# Altium schematic sheet Sheet1.SchDoc
size A2; SheetNumber: 1; SheetTotal: 1
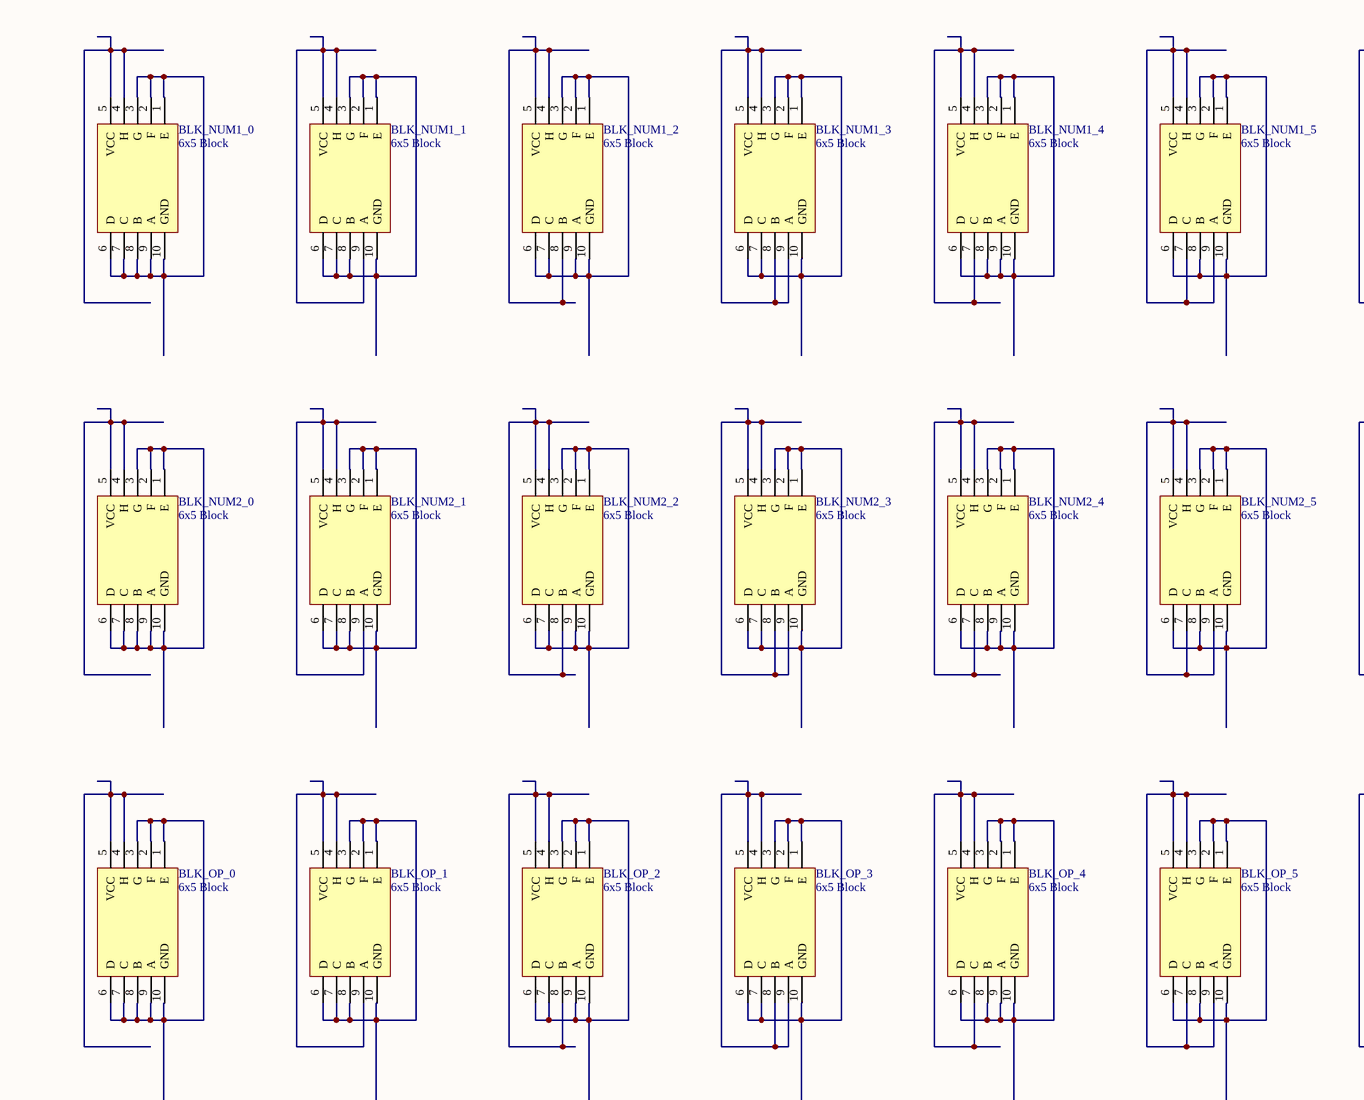
[diagram p0: Sheet1.SchDoc, left]
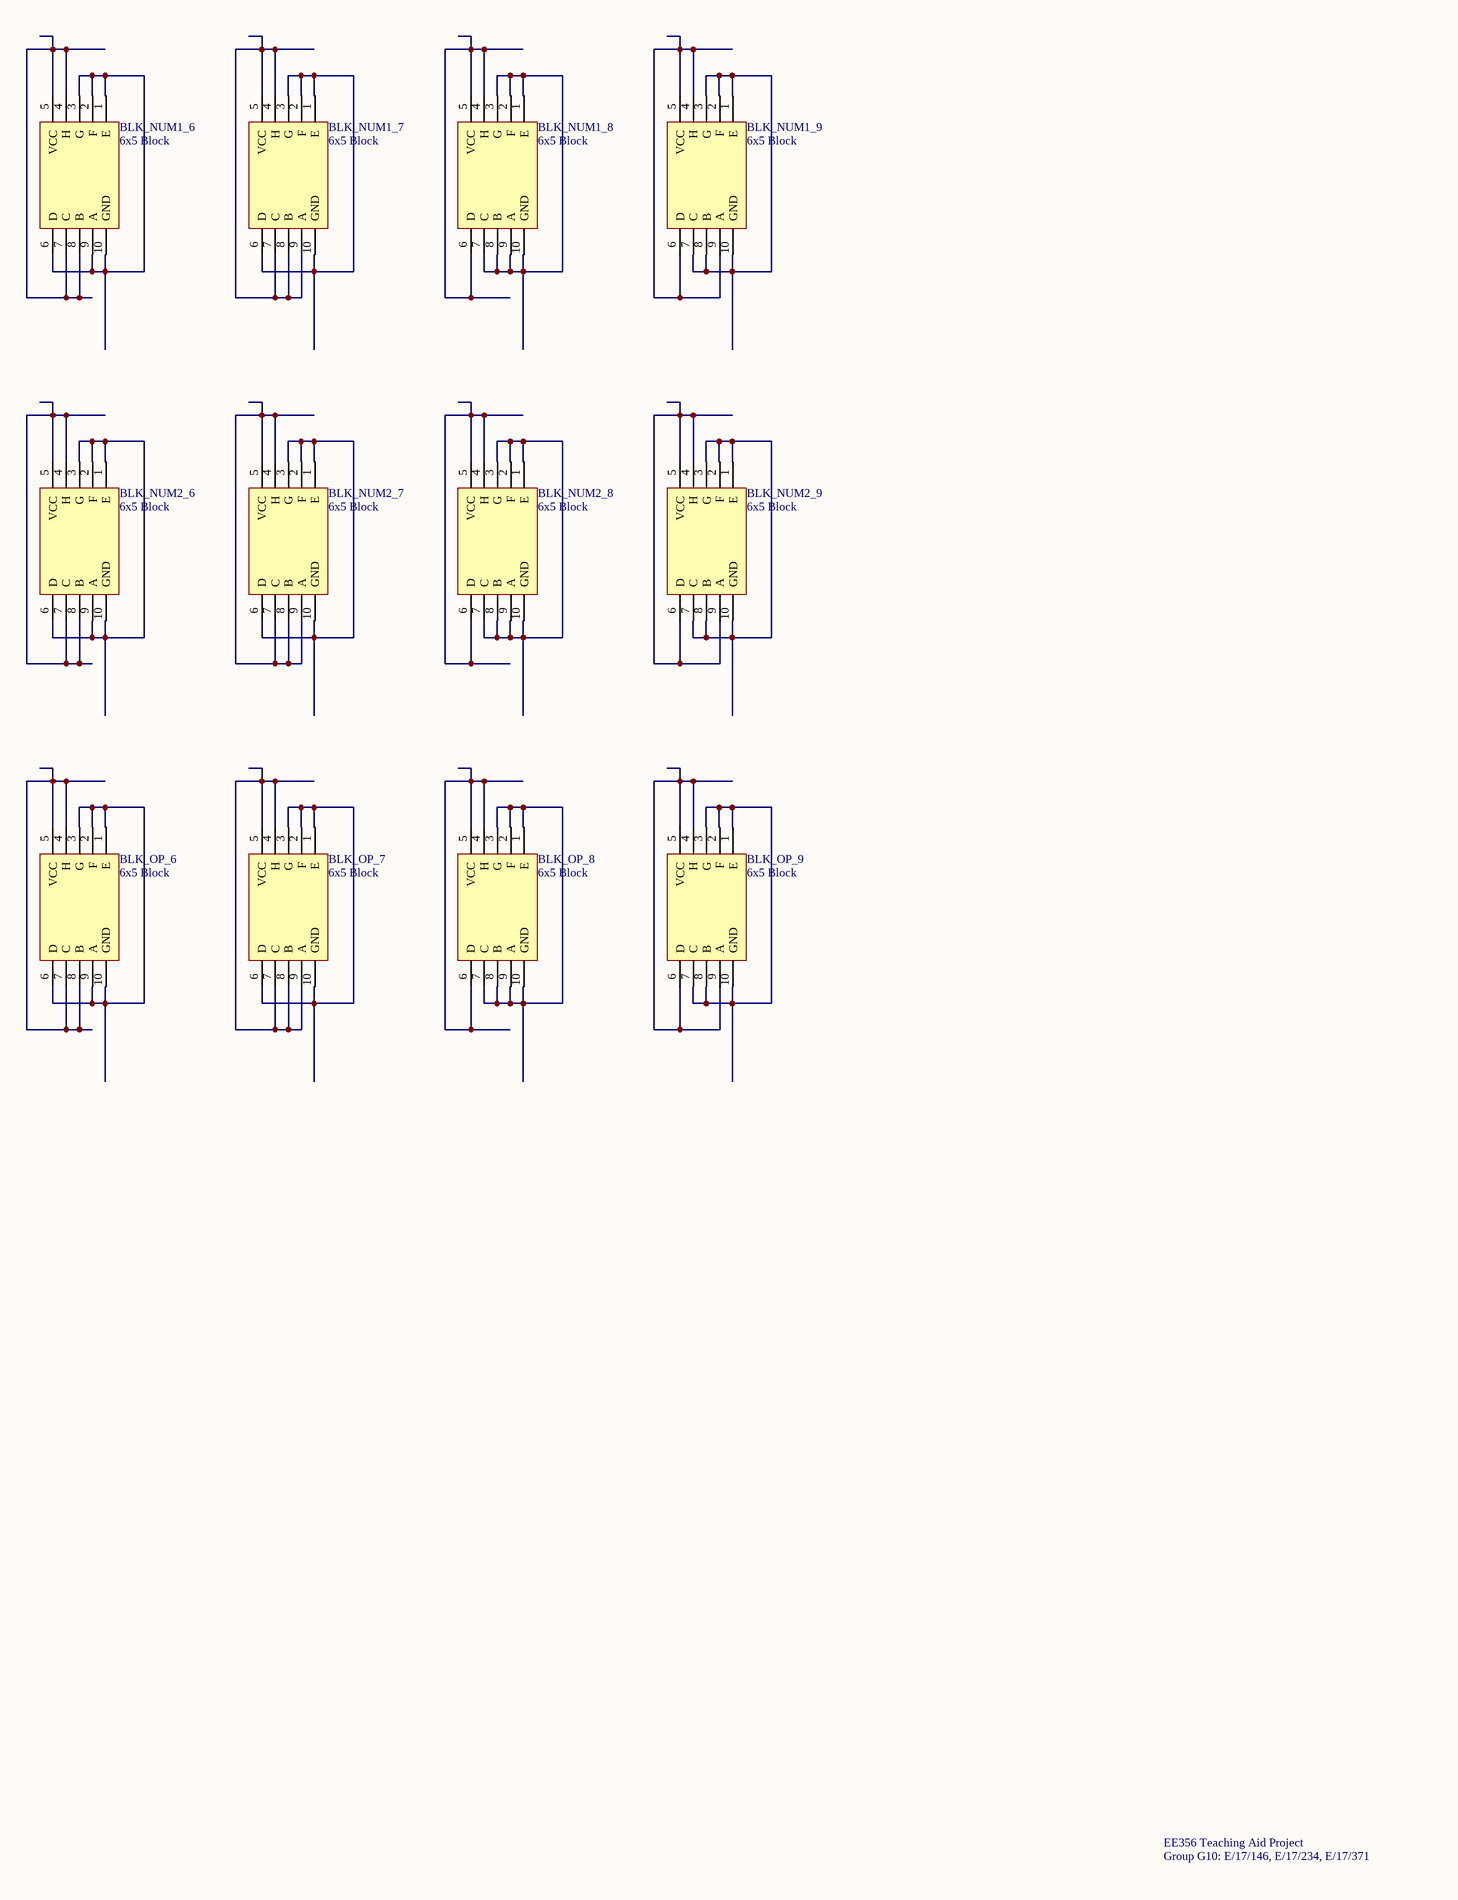
[diagram p1: Sheet1.SchDoc, right]

## Parts
BLK_NUM1_0  6x5 Block  [Block_6x5]
BLK_NUM1_1  6x5 Block  [Block_6x5]
BLK_NUM1_2  6x5 Block  [Block_6x5]
BLK_NUM1_3  6x5 Block  [Block_6x5]
BLK_NUM1_4  6x5 Block  [Block_6x5]
BLK_NUM1_5  6x5 Block  [Block_6x5]
BLK_NUM1_6  6x5 Block  [Block_6x5]
BLK_NUM1_7  6x5 Block  [Block_6x5]
BLK_NUM1_8  6x5 Block  [Block_6x5]
BLK_NUM1_9  6x5 Block  [Block_6x5]
BLK_NUM2_0  6x5 Block  [Block_6x5]
BLK_NUM2_1  6x5 Block  [Block_6x5]
BLK_NUM2_2  6x5 Block  [Block_6x5]
BLK_NUM2_3  6x5 Block  [Block_6x5]
BLK_NUM2_4  6x5 Block  [Block_6x5]
BLK_NUM2_5  6x5 Block  [Block_6x5]
BLK_NUM2_6  6x5 Block  [Block_6x5]
BLK_NUM2_7  6x5 Block  [Block_6x5]
BLK_NUM2_8  6x5 Block  [Block_6x5]
BLK_NUM2_9  6x5 Block  [Block_6x5]
BLK_OP_0  6x5 Block  [Block_6x5]
BLK_OP_1  6x5 Block  [Block_6x5]
BLK_OP_2  6x5 Block  [Block_6x5]
BLK_OP_3  6x5 Block  [Block_6x5]
BLK_OP_4  6x5 Block  [Block_6x5]
BLK_OP_5  6x5 Block  [Block_6x5]
BLK_OP_6  6x5 Block  [Block_6x5]
BLK_OP_7  6x5 Block  [Block_6x5]
BLK_OP_8  6x5 Block  [Block_6x5]
BLK_OP_9  6x5 Block  [Block_6x5]

## Nets
NetBLK_NUM1_0_1: BLK_NUM1_0.1(E) BLK_NUM1_0.2(F) BLK_NUM1_0.3(G) BLK_NUM1_0.6(D) BLK_NUM1_0.7(C) BLK_NUM1_0.8(B) BLK_NUM1_0.9(A) BLK_NUM1_0.10(GND)
NetBLK_NUM1_0_4: BLK_NUM1_0.4(H) BLK_NUM1_0.5(VCC)
NetBLK_NUM1_1_1: BLK_NUM1_1.1(E) BLK_NUM1_1.2(F) BLK_NUM1_1.3(G) BLK_NUM1_1.6(D) BLK_NUM1_1.7(C) BLK_NUM1_1.8(B) BLK_NUM1_1.10(GND)
NetBLK_NUM1_1_4: BLK_NUM1_1.4(H) BLK_NUM1_1.5(VCC) BLK_NUM1_1.9(A)
NetBLK_NUM1_2_1: BLK_NUM1_2.1(E) BLK_NUM1_2.2(F) BLK_NUM1_2.3(G) BLK_NUM1_2.6(D) BLK_NUM1_2.7(C) BLK_NUM1_2.9(A) BLK_NUM1_2.10(GND)
NetBLK_NUM1_2_4: BLK_NUM1_2.4(H) BLK_NUM1_2.5(VCC) BLK_NUM1_2.8(B)
NetBLK_NUM1_3_1: BLK_NUM1_3.1(E) BLK_NUM1_3.2(F) BLK_NUM1_3.3(G) BLK_NUM1_3.6(D) BLK_NUM1_3.7(C) BLK_NUM1_3.10(GND)
NetBLK_NUM1_3_4: BLK_NUM1_3.4(H) BLK_NUM1_3.5(VCC) BLK_NUM1_3.8(B) BLK_NUM1_3.9(A)
NetBLK_NUM1_4_1: BLK_NUM1_4.1(E) BLK_NUM1_4.2(F) BLK_NUM1_4.3(G) BLK_NUM1_4.6(D) BLK_NUM1_4.8(B) BLK_NUM1_4.9(A) BLK_NUM1_4.10(GND)
NetBLK_NUM1_4_4: BLK_NUM1_4.4(H) BLK_NUM1_4.5(VCC) BLK_NUM1_4.7(C)
NetBLK_NUM1_5_1: BLK_NUM1_5.1(E) BLK_NUM1_5.2(F) BLK_NUM1_5.3(G) BLK_NUM1_5.6(D) BLK_NUM1_5.8(B) BLK_NUM1_5.10(GND)
NetBLK_NUM1_5_4: BLK_NUM1_5.4(H) BLK_NUM1_5.5(VCC) BLK_NUM1_5.7(C) BLK_NUM1_5.9(A)
NetBLK_NUM1_6_1: BLK_NUM1_6.1(E) BLK_NUM1_6.2(F) BLK_NUM1_6.3(G) BLK_NUM1_6.6(D) BLK_NUM1_6.9(A) BLK_NUM1_6.10(GND)
NetBLK_NUM1_6_4: BLK_NUM1_6.4(H) BLK_NUM1_6.5(VCC) BLK_NUM1_6.7(C) BLK_NUM1_6.8(B)
NetBLK_NUM1_7_1: BLK_NUM1_7.1(E) BLK_NUM1_7.2(F) BLK_NUM1_7.3(G) BLK_NUM1_7.6(D) BLK_NUM1_7.10(GND)
NetBLK_NUM1_7_4: BLK_NUM1_7.4(H) BLK_NUM1_7.5(VCC) BLK_NUM1_7.7(C) BLK_NUM1_7.8(B) BLK_NUM1_7.9(A)
NetBLK_NUM1_8_1: BLK_NUM1_8.1(E) BLK_NUM1_8.2(F) BLK_NUM1_8.3(G) BLK_NUM1_8.7(C) BLK_NUM1_8.8(B) BLK_NUM1_8.9(A) BLK_NUM1_8.10(GND)
NetBLK_NUM1_8_4: BLK_NUM1_8.4(H) BLK_NUM1_8.5(VCC) BLK_NUM1_8.6(D)
NetBLK_NUM1_9_1: BLK_NUM1_9.1(E) BLK_NUM1_9.2(F) BLK_NUM1_9.3(G) BLK_NUM1_9.7(C) BLK_NUM1_9.8(B) BLK_NUM1_9.10(GND)
NetBLK_NUM1_9_4: BLK_NUM1_9.4(H) BLK_NUM1_9.5(VCC) BLK_NUM1_9.6(D) BLK_NUM1_9.9(A)
NetBLK_NUM2_0_1: BLK_NUM2_0.1(E) BLK_NUM2_0.2(F) BLK_NUM2_0.3(G) BLK_NUM2_0.6(D) BLK_NUM2_0.7(C) BLK_NUM2_0.8(B) BLK_NUM2_0.9(A) BLK_NUM2_0.10(GND)
NetBLK_NUM2_0_4: BLK_NUM2_0.4(H) BLK_NUM2_0.5(VCC)
NetBLK_NUM2_1_1: BLK_NUM2_1.1(E) BLK_NUM2_1.2(F) BLK_NUM2_1.3(G) BLK_NUM2_1.6(D) BLK_NUM2_1.7(C) BLK_NUM2_1.8(B) BLK_NUM2_1.10(GND)
NetBLK_NUM2_1_4: BLK_NUM2_1.4(H) BLK_NUM2_1.5(VCC) BLK_NUM2_1.9(A)
NetBLK_NUM2_2_1: BLK_NUM2_2.1(E) BLK_NUM2_2.2(F) BLK_NUM2_2.3(G) BLK_NUM2_2.6(D) BLK_NUM2_2.7(C) BLK_NUM2_2.9(A) BLK_NUM2_2.10(GND)
NetBLK_NUM2_2_4: BLK_NUM2_2.4(H) BLK_NUM2_2.5(VCC) BLK_NUM2_2.8(B)
NetBLK_NUM2_3_1: BLK_NUM2_3.1(E) BLK_NUM2_3.2(F) BLK_NUM2_3.3(G) BLK_NUM2_3.6(D) BLK_NUM2_3.7(C) BLK_NUM2_3.10(GND)
NetBLK_NUM2_3_4: BLK_NUM2_3.4(H) BLK_NUM2_3.5(VCC) BLK_NUM2_3.8(B) BLK_NUM2_3.9(A)
NetBLK_NUM2_4_1: BLK_NUM2_4.1(E) BLK_NUM2_4.2(F) BLK_NUM2_4.3(G) BLK_NUM2_4.6(D) BLK_NUM2_4.8(B) BLK_NUM2_4.9(A) BLK_NUM2_4.10(GND)
NetBLK_NUM2_4_4: BLK_NUM2_4.4(H) BLK_NUM2_4.5(VCC) BLK_NUM2_4.7(C)
NetBLK_NUM2_5_1: BLK_NUM2_5.1(E) BLK_NUM2_5.2(F) BLK_NUM2_5.3(G) BLK_NUM2_5.6(D) BLK_NUM2_5.8(B) BLK_NUM2_5.10(GND)
NetBLK_NUM2_5_4: BLK_NUM2_5.4(H) BLK_NUM2_5.5(VCC) BLK_NUM2_5.7(C) BLK_NUM2_5.9(A)
NetBLK_NUM2_6_1: BLK_NUM2_6.1(E) BLK_NUM2_6.2(F) BLK_NUM2_6.3(G) BLK_NUM2_6.6(D) BLK_NUM2_6.9(A) BLK_NUM2_6.10(GND)
NetBLK_NUM2_6_4: BLK_NUM2_6.4(H) BLK_NUM2_6.5(VCC) BLK_NUM2_6.7(C) BLK_NUM2_6.8(B)
NetBLK_NUM2_7_1: BLK_NUM2_7.1(E) BLK_NUM2_7.2(F) BLK_NUM2_7.3(G) BLK_NUM2_7.6(D) BLK_NUM2_7.10(GND)
NetBLK_NUM2_7_4: BLK_NUM2_7.4(H) BLK_NUM2_7.5(VCC) BLK_NUM2_7.7(C) BLK_NUM2_7.8(B) BLK_NUM2_7.9(A)
NetBLK_NUM2_8_1: BLK_NUM2_8.1(E) BLK_NUM2_8.2(F) BLK_NUM2_8.3(G) BLK_NUM2_8.7(C) BLK_NUM2_8.8(B) BLK_NUM2_8.9(A) BLK_NUM2_8.10(GND)
NetBLK_NUM2_8_4: BLK_NUM2_8.4(H) BLK_NUM2_8.5(VCC) BLK_NUM2_8.6(D)
NetBLK_NUM2_9_1: BLK_NUM2_9.1(E) BLK_NUM2_9.2(F) BLK_NUM2_9.3(G) BLK_NUM2_9.7(C) BLK_NUM2_9.8(B) BLK_NUM2_9.10(GND)
NetBLK_NUM2_9_4: BLK_NUM2_9.4(H) BLK_NUM2_9.5(VCC) BLK_NUM2_9.6(D) BLK_NUM2_9.9(A)
NetBLK_OP_0_1: BLK_OP_0.1(E) BLK_OP_0.2(F) BLK_OP_0.3(G) BLK_OP_0.6(D) BLK_OP_0.7(C) BLK_OP_0.8(B) BLK_OP_0.9(A) BLK_OP_0.10(GND)
NetBLK_OP_0_4: BLK_OP_0.4(H) BLK_OP_0.5(VCC)
NetBLK_OP_1_1: BLK_OP_1.1(E) BLK_OP_1.2(F) BLK_OP_1.3(G) BLK_OP_1.6(D) BLK_OP_1.7(C) BLK_OP_1.8(B) BLK_OP_1.10(GND)
NetBLK_OP_1_4: BLK_OP_1.4(H) BLK_OP_1.5(VCC) BLK_OP_1.9(A)
NetBLK_OP_2_1: BLK_OP_2.1(E) BLK_OP_2.2(F) BLK_OP_2.3(G) BLK_OP_2.6(D) BLK_OP_2.7(C) BLK_OP_2.9(A) BLK_OP_2.10(GND)
NetBLK_OP_2_4: BLK_OP_2.4(H) BLK_OP_2.5(VCC) BLK_OP_2.8(B)
NetBLK_OP_3_1: BLK_OP_3.1(E) BLK_OP_3.2(F) BLK_OP_3.3(G) BLK_OP_3.6(D) BLK_OP_3.7(C) BLK_OP_3.10(GND)
NetBLK_OP_3_4: BLK_OP_3.4(H) BLK_OP_3.5(VCC) BLK_OP_3.8(B) BLK_OP_3.9(A)
NetBLK_OP_4_1: BLK_OP_4.1(E) BLK_OP_4.2(F) BLK_OP_4.3(G) BLK_OP_4.6(D) BLK_OP_4.8(B) BLK_OP_4.9(A) BLK_OP_4.10(GND)
NetBLK_OP_4_4: BLK_OP_4.4(H) BLK_OP_4.5(VCC) BLK_OP_4.7(C)
NetBLK_OP_5_1: BLK_OP_5.1(E) BLK_OP_5.2(F) BLK_OP_5.3(G) BLK_OP_5.6(D) BLK_OP_5.8(B) BLK_OP_5.10(GND)
NetBLK_OP_5_4: BLK_OP_5.4(H) BLK_OP_5.5(VCC) BLK_OP_5.7(C) BLK_OP_5.9(A)
NetBLK_OP_6_1: BLK_OP_6.1(E) BLK_OP_6.2(F) BLK_OP_6.3(G) BLK_OP_6.6(D) BLK_OP_6.9(A) BLK_OP_6.10(GND)
NetBLK_OP_6_4: BLK_OP_6.4(H) BLK_OP_6.5(VCC) BLK_OP_6.7(C) BLK_OP_6.8(B)
NetBLK_OP_7_1: BLK_OP_7.1(E) BLK_OP_7.2(F) BLK_OP_7.3(G) BLK_OP_7.6(D) BLK_OP_7.10(GND)
NetBLK_OP_7_4: BLK_OP_7.4(H) BLK_OP_7.5(VCC) BLK_OP_7.7(C) BLK_OP_7.8(B) BLK_OP_7.9(A)
NetBLK_OP_8_1: BLK_OP_8.1(E) BLK_OP_8.2(F) BLK_OP_8.3(G) BLK_OP_8.7(C) BLK_OP_8.8(B) BLK_OP_8.9(A) BLK_OP_8.10(GND)
NetBLK_OP_8_4: BLK_OP_8.4(H) BLK_OP_8.5(VCC) BLK_OP_8.6(D)
NetBLK_OP_9_1: BLK_OP_9.1(E) BLK_OP_9.2(F) BLK_OP_9.3(G) BLK_OP_9.7(C) BLK_OP_9.8(B) BLK_OP_9.10(GND)
NetBLK_OP_9_4: BLK_OP_9.4(H) BLK_OP_9.5(VCC) BLK_OP_9.6(D) BLK_OP_9.9(A)

## Notes on the sheet
- EE356 Teaching Aid Project
- Group G10: E/17/146, E/17/234, E/17/371

## Library data of the parts
BLK_NUM1_0-BLK_NUM1_9 BLK_NUM2_0-BLK_NUM2_9 BLK_OP_0-BLK_OP_9 = Block_6x5